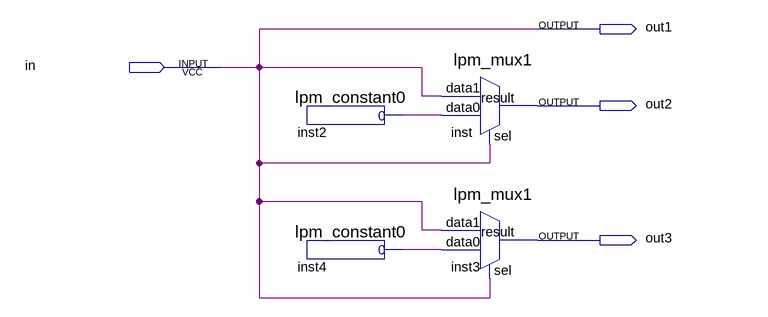
[diagram p0: schematic sheet]
// Quartus schematic 1to3.bdf as structural Verilog: 4 symbols, 4 pins
module \1to3  (
  input  in,
  output out1,
  output out2,
  output out3
);

  wire inst2_result, inst4_result;

  lpm_constant0 inst2 (.result(inst2_result));
  lpm_constant0 inst4 (.result(inst4_result));
  lpm_mux1 inst (.data1(in), .data0(inst2_result), .sel(in), .result(out2));
  lpm_mux1 inst3 (.data1(in), .data0(inst4_result), .sel(in), .result(out3));

  assign out1 = in;
endmodule
